# EasyEDA schematic SCH_Moon.json
TITLE: Sheet_1; REV: 1.0; Date: 2024-06-01; Sheet: 1/1; Drawn By: Selene Jiang-Qin; Company: Your Company
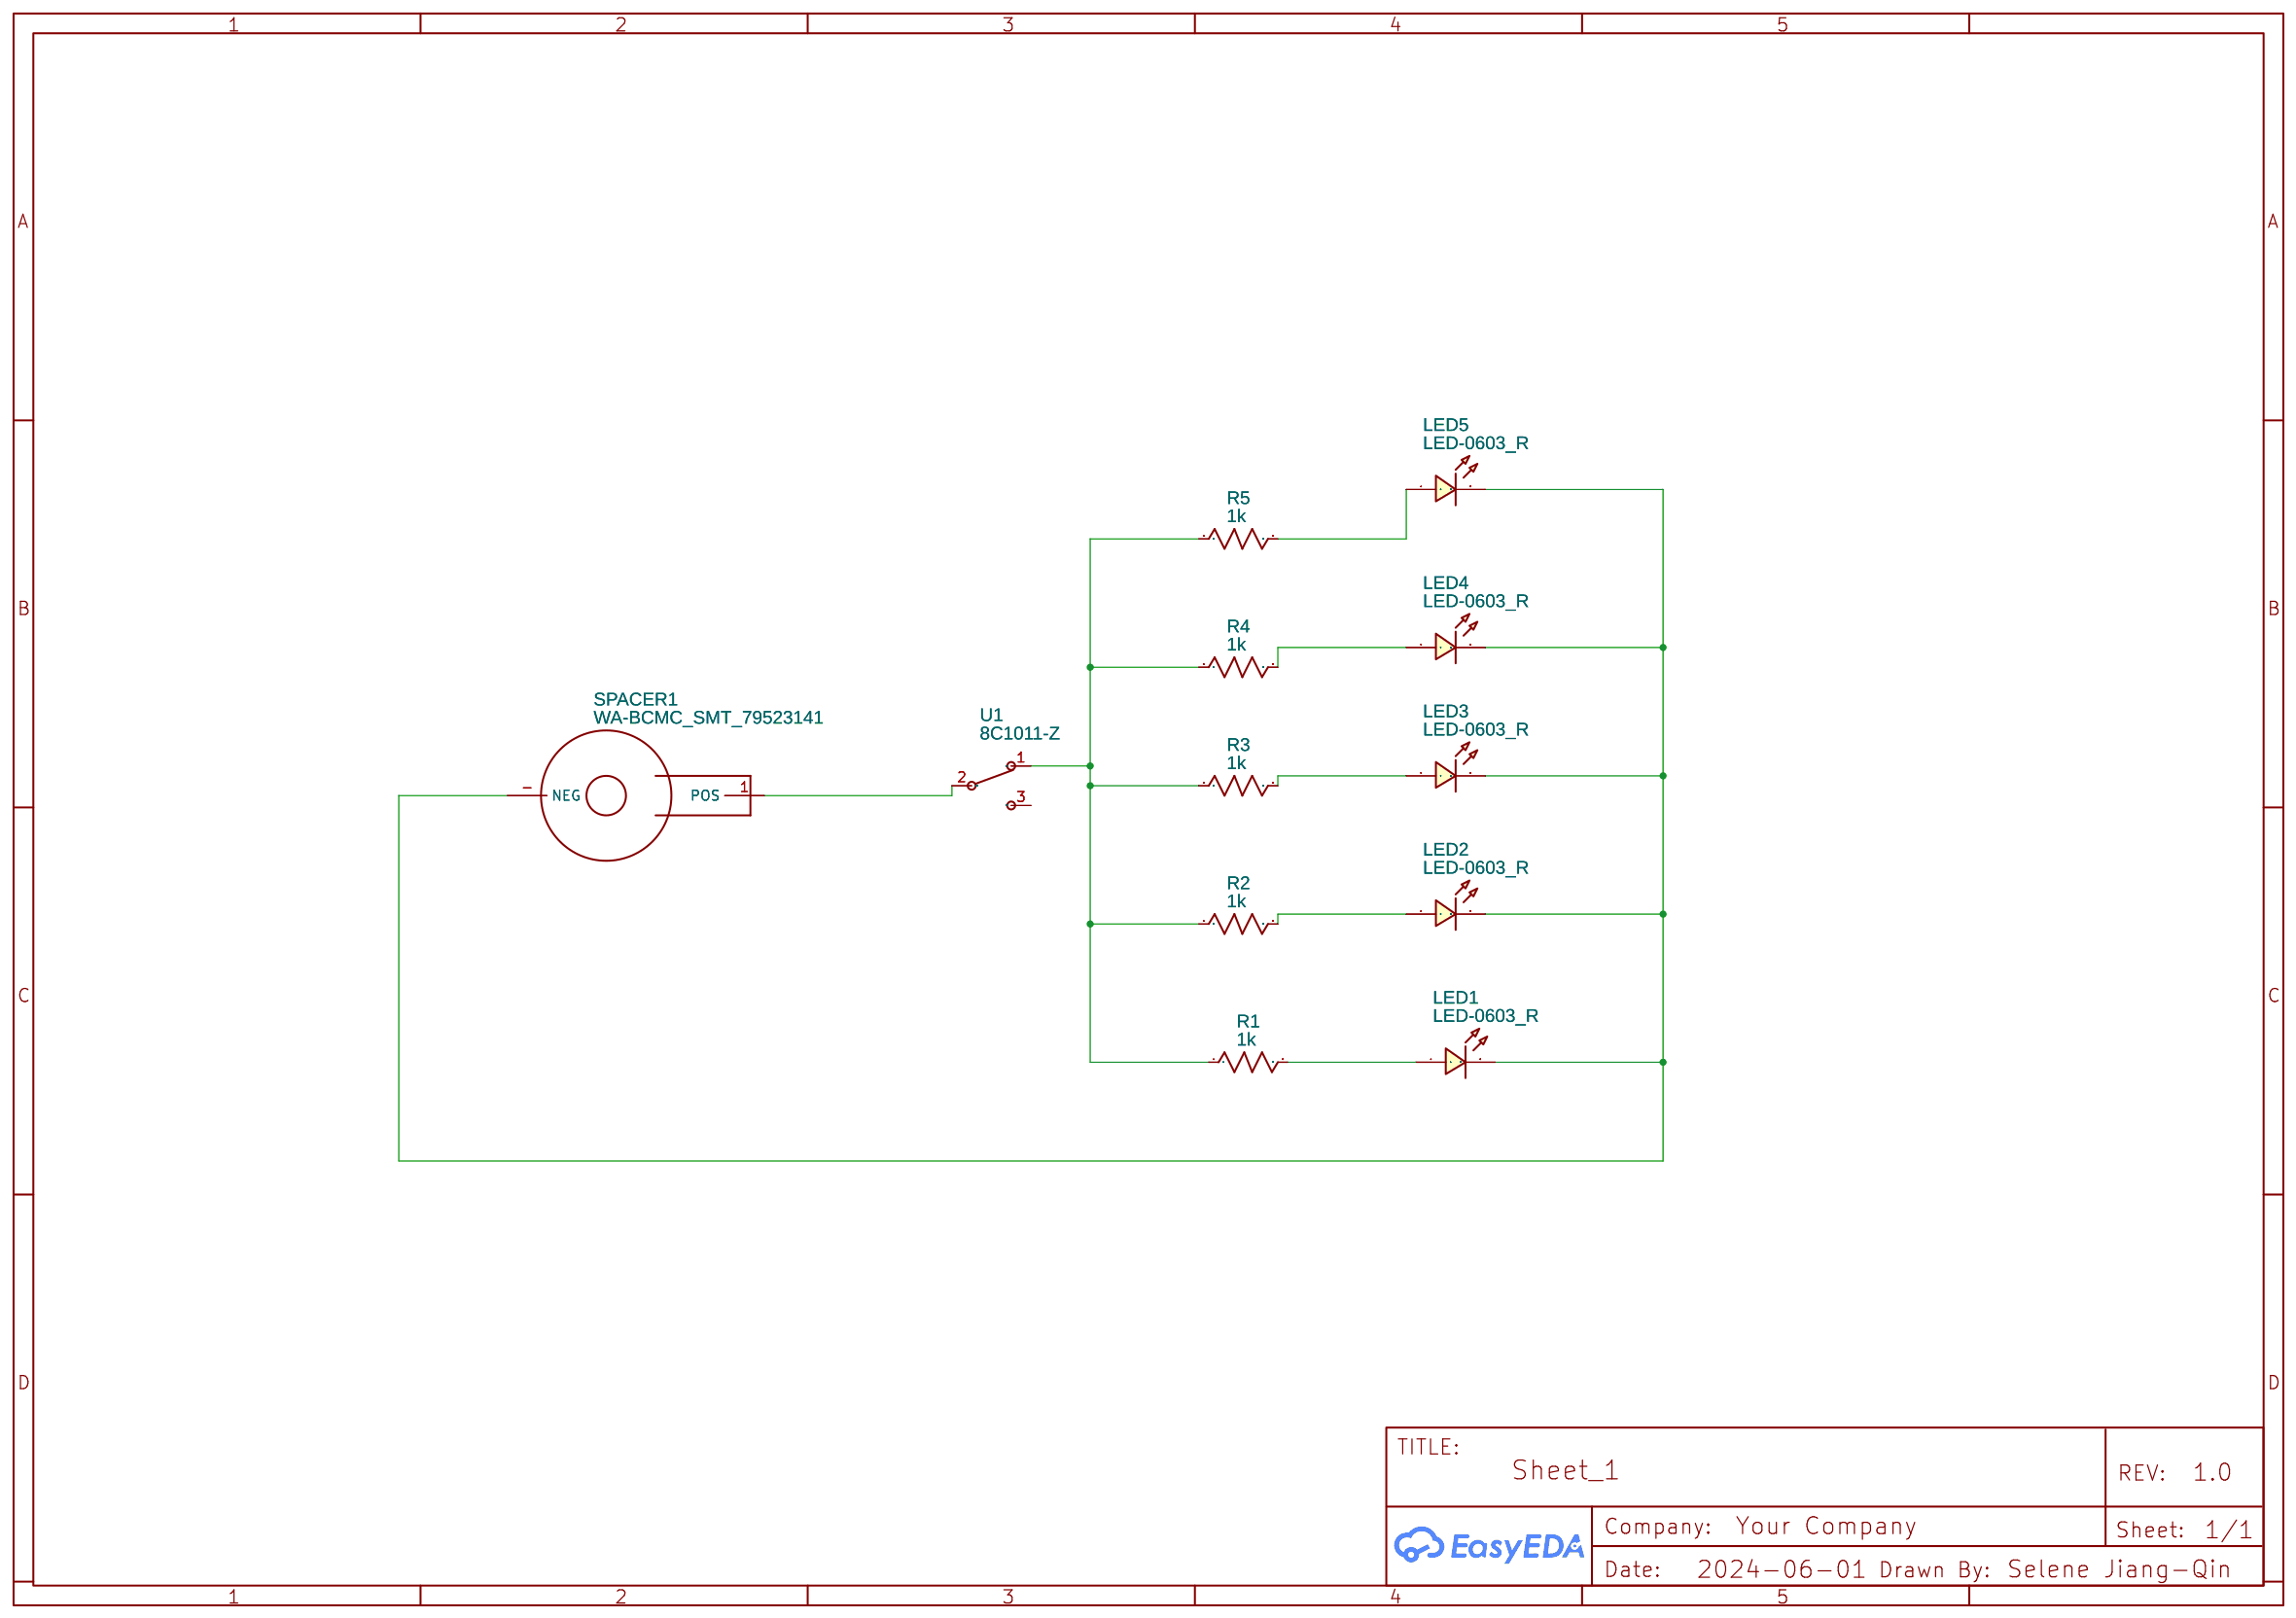
[diagram p0: schematic sheet]

## Parts
LED1  LED-0603_R  [LED0603_RED]
LED2  LED-0603_R  [LED0603_RED]
LED3  LED-0603_R  [LED0603_RED]
LED4  LED-0603_R  [LED0603_RED]
LED5  LED-0603_R  [LED0603_RED]
R1  1k  [R0603]
R2  1k  [R0603]
R3  1k  [R0603]
R4  1k  [R0603]
R5  1k  [R0603]
SPACER1  WA-BCMC_SMT_79523141  [79523141]
U1  8C1011-Z  [SW-TH_3P-L13.0-W8.0-P4.50]

## Library data of the parts
LED1-LED5 = LED-0603_R: Manufacturer: EVERLIGHT(台湾亿光); Manufacturer Part: 19-217/R6C-AL1M2VY/3T; Supplier Part: C72044; Supplier: LCSC; Contributor: LCEDA_01
R1-R5 = R_0603_US: Contributor: LCEDA_Lib
SPACER1 = WA-BCMC_SMT_79523141: Battery Holder WA-BCMC
U1 = 8C1011-Z: Contributor: lcsc; Supplier: LCSC; Supplier Part: C3010035; Manufacturer: NIDEC(尼得科); JLCPCB Part Class: Extended Part

## Nets
Net-(LED1-1): LED1.1 R1.2
Net-(LED1-2): LED1.2 LED2.2 LED3.2 LED4.2 LED5.2 SPACER1.-(NEG)
Net-(LED2-1): LED2.1 R2.2
Net-(LED3-1): LED3.1 R3.2
Net-(LED4-1): LED4.1 R4.2
Net-(LED5-1): LED5.1 R5.2
Net-(R1-1): R1.1 R2.1 R3.1 R4.1 R5.1 U1.1(ON)
Net-(SPACER1-1): SPACER1.1(POS) U1.2(COMM)

Not connected (* = marked no-connect by the designer): U1 3(NC)
